# EAGLE design OSO-MISC-20-011 Capacitive Soil Moisture Spike (EAGLE 9.4.2)
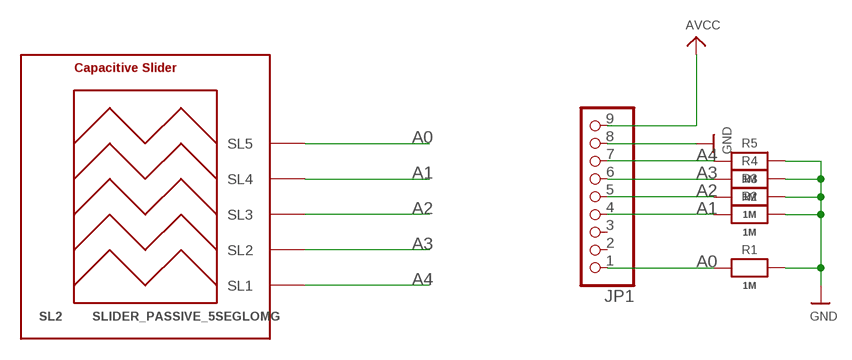
[diagram p0: schematic, sheet 1]

## Parts
JP1  HEADER-1X9_JSTSH  [JST_SH9]
R1  1M  RESISTOR_0603_NOOUT  [0603-NO]
R2  1M  RESISTOR_0603_NOOUT  [0603-NO]
R3  1M  RESISTOR_0603_NOOUT  [0603-NO]
R4  1M  RESISTOR_0603_NOOUT  [0603-NO]
R5  1M  RESISTOR_0603_NOOUT  [0603-NO]
SL2  SLIDER_PASSIVE_5SEGLOMG  [SLIDER_PASSIVE_5SEG_12MM_LOMG]

## Nets
A0: JP1.1 R1.1 SL2.SL5
A1: JP1.4 R2.1 SL2.SL4
A2: JP1.5 R3.1 SL2.SL3
A3: JP1.6 R4.1 SL2.SL2
A4: JP1.7 R5.1 SL2.SL1
AVCC [power]: JP1.9
GND: JP1.8 R1.2 R2.2 R3.2 R4.2 R5.2
Unconnected: JP1.2 JP1.3

## Library data of the parts
JP1 = microbuilder:HEADER-1X9: PIN HEADER
R1-R5 = microbuilder:RESISTOR: Resistors For new designs, use the packages preceded by an '_' character since they are more reliable: The following footprints should be used on most boards: _0402 - Standard footprint for regular board layouts _0603 - Standard footprint for regular board layouts _0805 - Standard footprint for regular board layouts _1206 - Standard footprint for regular board layouts For extremely tight-pitch boards where space is at a premium, the following 'micro-pitch' footprints can be used (smaller pads, no silkscreen outline, etc.): _0402MP - Micro-pitch footprint for very dense/compact boards _0603MP - Micro-pitch footprint for very dense/compact boards _0805MP - Micro-pitch footprint for very dense/compact boards _1206MP - Micro-pitch footprint for very dense/compact boards
SL2 = PatternAgents-TouchWidgets:SLIDER_PASSIVE_5SEG: Slider, Passive Touch/Capacitive Sensing Type, Five (5) Segment Source : http://www.PatternAgents.com Github : https://github.com/PatternAgents License : http://creativecommons.org/licenses/by-sa/3.1/ (Creative Commons 3.1) THIS SOFTWARE IS PROVIDED BY THE CONTRIBUTORS "AS IS" AND WITHOUT ANY EXPRESS OR IMPLIED WARRANTIES, INCLUDING, BUT NOT LIMITED TO, THE IMPLIED WARRANTIES OF MERCHANTABILITY AND FITNESS FOR A PARTICULAR PURPOSE ARE DISCLAIMED. IN NO EVENT SHALL THE COPYRIGHT OWNER OR CONTRIBUTORS BE LIABLE FOR ANY DIRECT, INDIRECT, INCIDENTAL, SPECIAL, EXEMPLARY, OR CONSEQUENTIAL DAMAGES (INCLUDING, BUT NOT LIMITED TO, PROCUREMENT OF SUBSTITUTE GOODS OR SERVICES; LOSS OF USE, DATA, OR PROFITS; OR BUSINESS INTERRUPTION) HOWEVER CAUSED AND ON ANY THEORY OF LIABILITY, WHETHER IN CONTRACT, STRICT LIABILITY, OR TORT (INCLUDING NEGLIGENCE OR OTHERWISE) ARISING IN ANY WAY OUT OF THE USE OF THIS SOFTWARE, EVEN IF ADVISED OF THE POSSIBILITY OF SUCH DAMAGE.

## Net classes
0 default: width 0.152 mm, drill 0.254 mm
1 power: width 0.305 mm, drill 0.305 mm

## Board
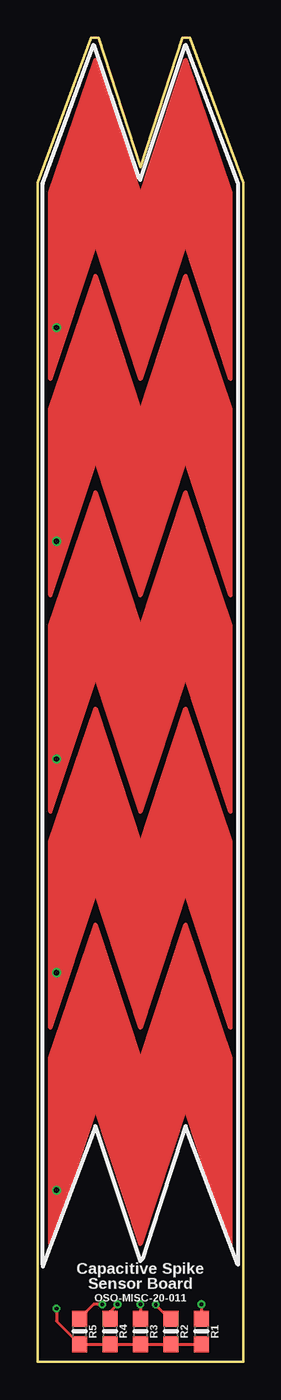
[diagram p1: board, top side]
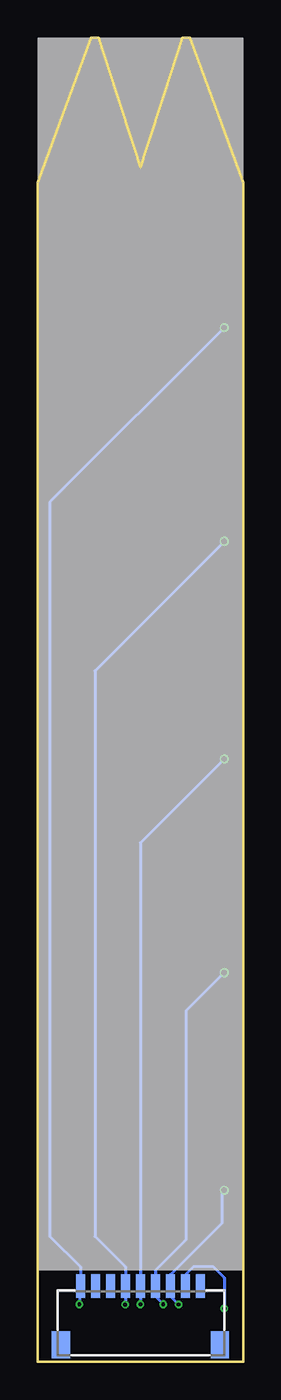
[diagram p2: board, bottom side, seen from below]

Size 13.72 x 88.14 mm. Coordinates in mm from the lower left corner, seen from the top.
Outline: 0,78.49 3.56,88.14 4.06,88.14 6.86,79.5 9.65,88.14 10.16,88.14 13.72,78.49 13.72,0 0,0 0,78.49
Copper layers (1*16): Top 0.035559375mm / dielectric 1.6mm / Bottom 0.035559375mm
Design rules "oshpark-2layer *": minimum track width 6mil, minimum drill 10mil, track to track 6mil, track to pad 6mil, pad to pad 6mil, via to via 6mil, smd to smd 6mil, copper to edge 15mil, drill to drill 6mil, minimum pad ring 5mil, minimum via ring 5mil, stop-mask expansion 2.5mil, vias tented up to drill 12mil, thermal gap 10mil

### Footprints (pad centres in the part's own frame; a part is rotated, then mirrored left to right if it is on the bottom)
JST_SH9 = smd 0.6 x 1.55: 1 -4,2.514; 2 -3,2.514; 3 -2,2.514; 4 -1,2.514; 5 0,2.514; 6 1,2.514; 7 2,2.514; 8 3,2.514; 9 4,2.514 | smd 1.2 x 1.8: MT1 -5.3,-1.386; MT2 5.3,-1.386
0603-NO = smd 1.075 x 1: 1 -0.85,0; 2 0.85,0
SLIDER_PASSIVE_5SEG_12MM_LOMG = drill 0.356: SL1 -5.588,-36.322; SL2 -5.588,-21.844; SL3 -5.588,-7.62; SL4 -5.588,6.858; SL5 -5.588,21.082

### Placement (x,y rotation side)
JP1  6.86,2.54 0 bottom
R1  10.92,2.03 270 top
R2  8.89,2.03 270 top
R3  6.86,2.03 270 top
R4  4.83,2.03 270 top
R5  2.79,2.03 270 top
SL2  6.86,47.75 0 top

### Tracks (layer width: path | path; a pad name or v marks a point on that pad's centre or on a via)
A0  (via drill 0.25)
  Top 0.203: v10.92,3.83 R1.1
  Bottom 0.203: SL2.SL5 12.89,57.21 12.89,8.36 10.86,6.32 JP1.1 10.92,4.99 v10.92,3.83
A1  (via drill 0.25)
  Top 0.203: R2.1 8.8,2.88 v7.87,3.81
  Bottom 0.203: SL2.SL4 9.89,45.99 9.89,8.36 7.86,6.32 JP1.4 7.86,3.83 v7.87,3.81
A2  (via drill 0.25)
  Top 0.203: v6.86,3.83 R3.1
  Bottom 0.203: SL2.SL3 6.86,34.54 JP1.5 v6.86,3.83
A3  (via drill 0.25)
  Top 0.203: v5.33,3.83 v5.32,3.83 4.83,3.34 R4.1
  Bottom 0.203: SL2.SL2 3.81,23.37 3.81,8.14 5.86,6.1 JP1.6 5.86,4.36 v5.33,3.83
A4  (via drill 0.25)
  Top 0.203: v4.32,3.83 3.74,3.83 R5.1
  Bottom 0.203: v4.32,3.83 4.86,4.37 JP1.7 4.86,5.81 1.41,9.26 1.41,11.32 1.3,11.43 SL2.SL1
GND  (via drill 0.25)
  Top 0.203: R1.2 R2.2 R3.2 R4.2 R5.2 1.27,2.71 v1.27,3.56
  Bottom 0.203: JP1.8 3.86,5.79 3.3,6.35 2.03,6.35 1.27,5.59 v1.27,3.56

### Text on the board
tPlace: Capacitive Spike / Sensor Board | OSO-MISC-20-011